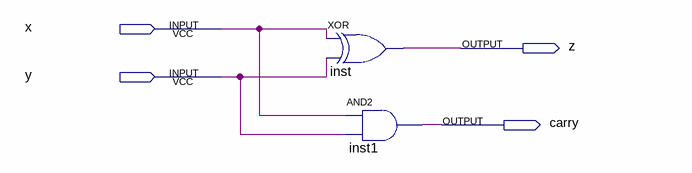
[diagram p0: schematic sheet]
// Quartus schematic ex1.bdf as structural Verilog: 2 symbols, 4 pins
module ex1 (
  input  x,
  input  y,
  output z,
  output carry
);

  xor inst (z, x, y);
  and inst1 (carry, x, y);
endmodule
